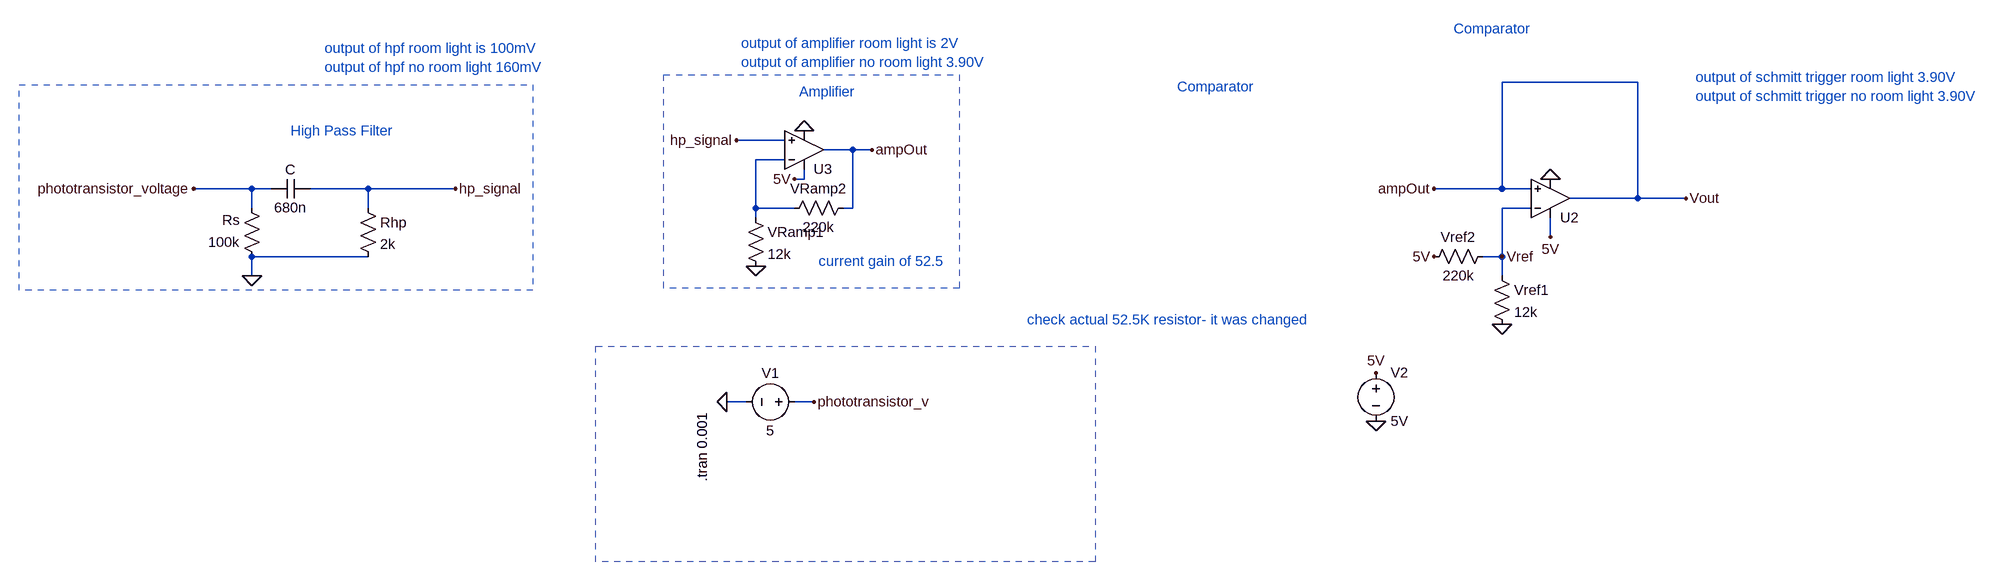
[diagram p0: schematic finale_schematic.asc]
finale_schematic.asc, the LTspice schematic file:
Version 4
SHEET 1 3660 1464
WIRE 3040 368 2816 368
WIRE 1632 464 1552 464
WIRE 1744 480 1696 480
WIRE 1776 480 1744 480
WIRE 1632 496 1584 496
WIRE 1664 528 1664 512
WIRE 1664 528 1648 528
WIRE 752 544 656 544
WIRE 784 544 752 544
WIRE 944 544 848 544
WIRE 1088 544 944 544
WIRE 2816 544 2816 368
WIRE 2816 544 2704 544
WIRE 2864 544 2816 544
WIRE 3040 560 3040 368
WIRE 3040 560 2928 560
WIRE 3120 560 3040 560
WIRE 752 576 752 544
WIRE 944 576 944 544
WIRE 1584 576 1584 496
WIRE 1648 576 1584 576
WIRE 1744 576 1744 480
WIRE 1744 576 1728 576
WIRE 2864 576 2816 576
WIRE 1584 592 1584 576
WIRE 2896 624 2896 592
WIRE 944 656 752 656
WIRE 2816 656 2816 576
WIRE 2816 656 2784 656
WIRE 752 688 752 656
WIRE 2816 688 2816 656
WIRE 1568 896 1536 896
WIRE 1680 896 1648 896
FLAG 1088 544 hp_signal
FLAG 1536 896 0
FLAG 1680 896 phototransistor_v
FLAG 752 688 0
FLAG 656 544 phototransistor_voltage
FLAG 2816 768 0
FLAG 2704 656 5V
FLAG 2608 928 0
FLAG 2608 848 5V
FLAG 3120 560 Vout
FLAG 2816 656 Vref
FLAG 1664 448 0
FLAG 1584 672 0
FLAG 1648 528 5V
FLAG 1776 480 ampOut
FLAG 2896 624 5V
FLAG 2896 528 0
FLAG 1552 464 hp_signal
FLAG 2704 544 ampOut
SYMBOL cap 848 528 R90
WINDOW 0 0 32 VBottom 2
WINDOW 3 32 32 VTop 2
SYMATTR InstName C
SYMATTR Value 680n
SYMBOL Res 928 560 R0
SYMATTR InstName Rhp
SYMATTR Value 2k
SYMBOL Voltage 1664 896 R90
WINDOW 3 32 56 VTop 2
WINDOW 0 -32 56 VBottom 2
SYMATTR Value 5
SYMATTR InstName V1
SYMATTR Value2 AC 1
SYMBOL Res 768 672 R180
WINDOW 0 36 76 Left 2
WINDOW 3 36 40 Left 2
SYMATTR InstName Rs
SYMATTR Value 100k
SYMBOL Res 2800 672 R0
SYMATTR InstName Vref1
SYMATTR Value 12k
SYMBOL Res 2800 640 R90
WINDOW 0 0 56 VBottom 2
WINDOW 3 32 56 VTop 2
SYMATTR InstName Vref2
SYMATTR Value 220k
SYMBOL Voltage 2608 832 R0
SYMATTR InstName V2
SYMATTR Value 5V
SYMBOL OpAmps/UniversalOpAmp 1664 480 M180
SYMATTR InstName U3
SYMBOL Res 1568 576 R0
SYMATTR InstName VRamp1
SYMATTR Value 12k
SYMBOL Res 1744 560 R90
WINDOW 0 0 56 VBottom 2
WINDOW 3 32 56 VTop 2
SYMATTR InstName VRamp2
SYMATTR Value 220k
SYMBOL OpAmps\\UniversalOpAmp 2896 560 M180
SYMATTR InstName U2
TEXT 816 448 Left 2 ;High Pass Filter
TEXT 1496 912 VRight 2 !.tran 0.001
TEXT 2736 280 Left 2 ;Comparator
TEXT 872 312 Left 2 ;output of hpf room light is 100mV \noutput of hpf no room light 160mV
TEXT 1688 664 Left 2 ;current gain of 52.5
TEXT 1560 304 Left 2 ;output of amplifier room light is 2V\noutput of amplifier no room light 3.90V
TEXT 3136 360 Left 2 ;output of schmitt trigger room light 3.90V\noutput of schmitt trigger no room light 3.90V
TEXT 2032 760 Left 2 ;check actual 52.5K resistor- it was changed
TEXT 1656 384 Left 2 ;Amplifier
TEXT 2280 376 Left 2 ;Comparator
RECTANGLE Normal 1320 804 2144 1160 2
RECTANGLE Normal 368 372 1216 712 2
RECTANGLE Normal 1432 356 1920 708 2

The netlist it stands for:
* finale_schematic.asc
C hp_signal phototransistor_voltage 680n
Rhp hp_signal 0 2k
V1 phototransistor_v 0 5 AC 1
Rs 0 phototransistor_voltage 100k
R§Vref1 Vref 0 12k
R§Vref2 Vref 5V 220k
V2 5V 0 5V
XU3 hp_signal N001 5V 0 ampOut level1 Avol=1Meg GBW=10Meg Vos=0 En=0 Enk=0 In=0 Ink=0 Rin=500Meg  ; pins In+ In- V+ V- OUT
R§VRamp1 N001 0 12k
R§VRamp2 ampOut N001 220k
XU2 ampOut Vref 5V 0 ampOut level1 Avol=1Meg GBW=10Meg Vos=0 En=0 Enk=0 In=0 Ink=0 Rin=500Meg  ; pins In+ In- V+ V- OUT
* High Pass Filter
.tran 0.001
* Comparator
* output of hpf room light is 100mV
* output of hpf no room light 160mV
* current gain of 52.5
* output of amplifier room light is 2V
* output of amplifier no room light 3.90V
* output of schmitt trigger room light 3.90V
* output of schmitt trigger no room light 3.90V
* check actual 52.5K resistor- it was changed
* Amplifier
* Comparator
.lib UniversalOpAmp1.lib
.backanno
.end